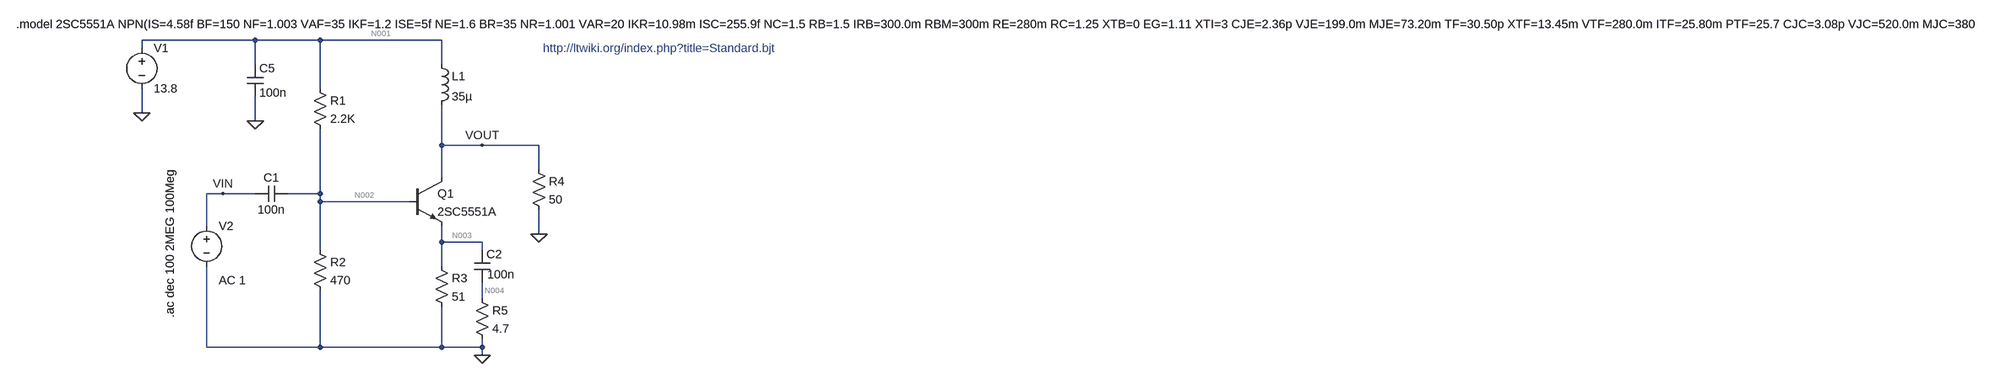
[diagram p0: schematic K&P_RF_AMP.asc]
K&P_RF_AMP.asc, the LTspice schematic file:
Version 4
SHEET 1 3972 680
WIRE -80 -144 -304 -144
WIRE 48 -144 -80 -144
WIRE 288 -144 48 -144
WIRE -304 -128 -304 -144
WIRE -80 -96 -80 -144
WIRE 288 -96 288 -144
WIRE 48 -48 48 -144
WIRE -304 0 -304 -48
WIRE -80 16 -80 -32
WIRE 288 64 288 -16
WIRE 368 64 288 64
WIRE 480 64 368 64
WIRE 480 112 480 64
WIRE 288 128 288 64
WIRE -144 160 -176 160
WIRE -80 160 -144 160
WIRE 48 160 48 32
WIRE 48 160 -16 160
WIRE 48 176 48 160
WIRE 224 176 48 176
WIRE -176 224 -176 160
WIRE 480 240 480 192
WIRE 288 256 288 224
WIRE 368 256 288 256
WIRE 48 272 48 176
WIRE 368 272 368 256
WIRE 288 304 288 256
WIRE 368 368 368 336
WIRE -176 464 -176 304
WIRE 48 464 48 352
WIRE 48 464 -176 464
WIRE 288 464 288 384
WIRE 288 464 48 464
WIRE 368 464 368 448
WIRE 368 464 288 464
WIRE 368 480 368 464
FLAG -304 0 0
FLAG 368 480 0
FLAG -144 160 VIN
FLAG 368 64 VOUT
FLAG -80 16 0
FLAG 480 240 0
SYMBOL res 32 -64 R0
SYMATTR InstName R1
SYMATTR Value 2.2K
SYMBOL res 32 256 R0
SYMATTR InstName R2
SYMATTR Value 470
SYMBOL cap -16 144 R90
WINDOW 0 0 32 VBottom 2
WINDOW 3 32 32 VTop 2
SYMATTR InstName C1
SYMATTR Value 100n
SYMBOL npn 224 128 R0
SYMATTR InstName Q1
SYMATTR Value 2SC5551A
SYMBOL ind 272 -112 R0
SYMATTR InstName L1
SYMATTR Value 35µ
SYMBOL res 272 288 R0
SYMATTR InstName R3
SYMATTR Value 51
SYMBOL cap 352 272 R0
WINDOW 3 26 48 Left 2
SYMATTR InstName C2
SYMATTR Value 100n
SYMBOL voltage -304 -144 R0
SYMATTR InstName V1
SYMATTR Value 13.8
SYMBOL voltage -176 208 R0
WINDOW 123 24 124 Left 2
WINDOW 39 0 0 Left 0
SYMATTR InstName V2
SYMATTR Value ""
SYMATTR Value2 AC 1
SYMBOL cap -96 -96 R0
SYMATTR InstName C5
SYMATTR Value 100n
SYMBOL res 352 352 R0
SYMATTR InstName R5
SYMATTR Value 4.7
SYMBOL res 464 96 R0
SYMATTR InstName R4
SYMATTR Value 50
TEXT -248 112 VRight 2 !.ac dec 100 2MEG 100Meg
TEXT -552 -176 Left 2 !.model 2SC5551A NPN(IS=4.58f BF=150 NF=1.003 VAF=35 IKF=1.2 ISE=5f NE=1.6 BR=35 NR=1.001 VAR=20 IKR=10.98m ISC=255.9f NC=1.5 RB=1.5 IRB=300.0m RBM=300m RE=280m RC=1.25 XTB=0 EG=1.11 XTI=3 CJE=2.36p VJE=199.0m MJE=73.20m TF=30.50p XTF=13.45m VTF=280.0m ITF=25.80m PTF=25.7 CJC=3.08p VJC=520.0m MJC=380.8m .15m TR=1.38n FC=1.51m )
TEXT 488 -128 Left 2 ;http://ltwiki.org/index.php?title=Standard.bjt

The netlist it stands for:
* K&P_RF_AMP.asc
R1 N001 N002 2.2K
R2 N002 0 470
C1 N002 VIN 100n
Q1 VOUT N002 N003 0 2SC5551A
L1 N001 VOUT 35µ
R3 N003 0 51
C2 N003 N004 100n
V1 N001 0 13.8
V2 VIN 0 AC 1
C5 N001 0 100n
R5 N004 0 4.7
R4 VOUT 0 50
.model NPN NPN
.model PNP PNP
.lib standard.bjt
.ac dec 100 2MEG 100Meg
.model 2SC5551A NPN(IS=4.58f BF=150 NF=1.003 VAF=35 IKF=1.2 ISE=5f NE=1.6 BR=35 NR=1.001 VAR=20 IKR=10.98m ISC=255.9f NC=1.5 RB=1.5 IRB=300.0m RBM=300m RE=280m RC=1.25 XTB=0 EG=1.11 XTI=3 CJE=2.36p VJE=199.0m MJE=73.20m TF=30.50p XTF=13.45m VTF=280.0m ITF=25.80m PTF=25.7 CJC=3.08p VJC=520.0m MJC=380.8m .15m TR=1.38n FC=1.51m )
* http://ltwiki.org/index.php?title=Standard.bjt
.backanno
.end

* Results of the author's LTspice run, read from the files saved beside the schematic
* Operating Point, zero values left out:
*   V(n001) = 13.8 V
*   V(n002) = 2.365 V
*   V(vout) = 13.8 V
*   V(n003) = 1.596 V
*   Ic(Q1) = 31.13 mA
*   Ib(Q1) = 164.9 µA
*   Ie(Q1) = -31.29 mA
*   I(L1) = 307.1 mA
*   I(R4) = 276 mA
*   I(R3) = 31.29 mA
*   I(R2) = 5.033 mA
*   I(R1) = 5.198 mA
*   I(V1) = -312.3 mA
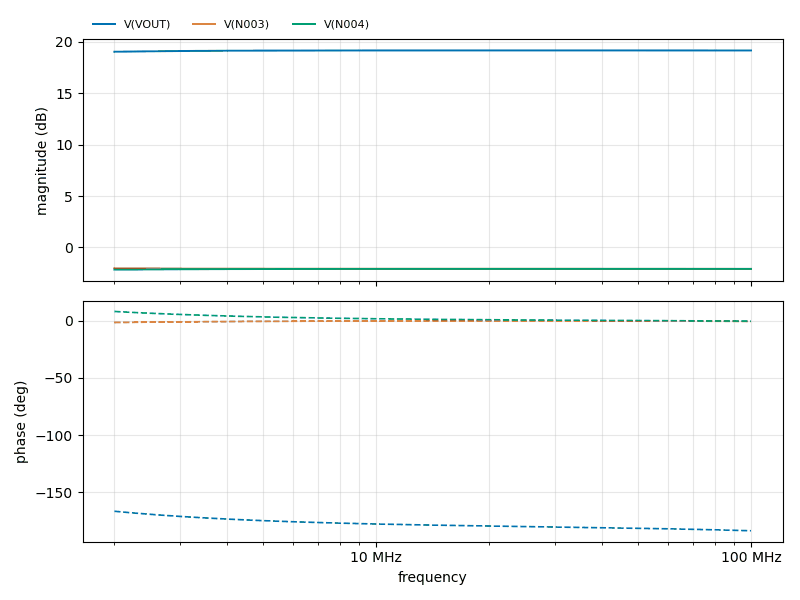
[diagram p1: AC Analysis of K&P_RF_AMP.asc, plotted from the saved traces]
* AC Analysis, 1 run:
*   V(VOUT): 19.03 dB at 2 MHz, 19.16 dB at 100 MHz, peak 19.17 dB at 28.25 MHz
*   V(N003): -2.04 dB at 2 MHz, -2.09 dB at 100 MHz, peak -2.04 dB at 2 MHz
*   V(N004): -2.17 dB at 2 MHz, -2.09 dB at 100 MHz, peak -2.09 dB at 28.25 MHz